# EAGLE schematic Schem1 (EAGLE 6.4)
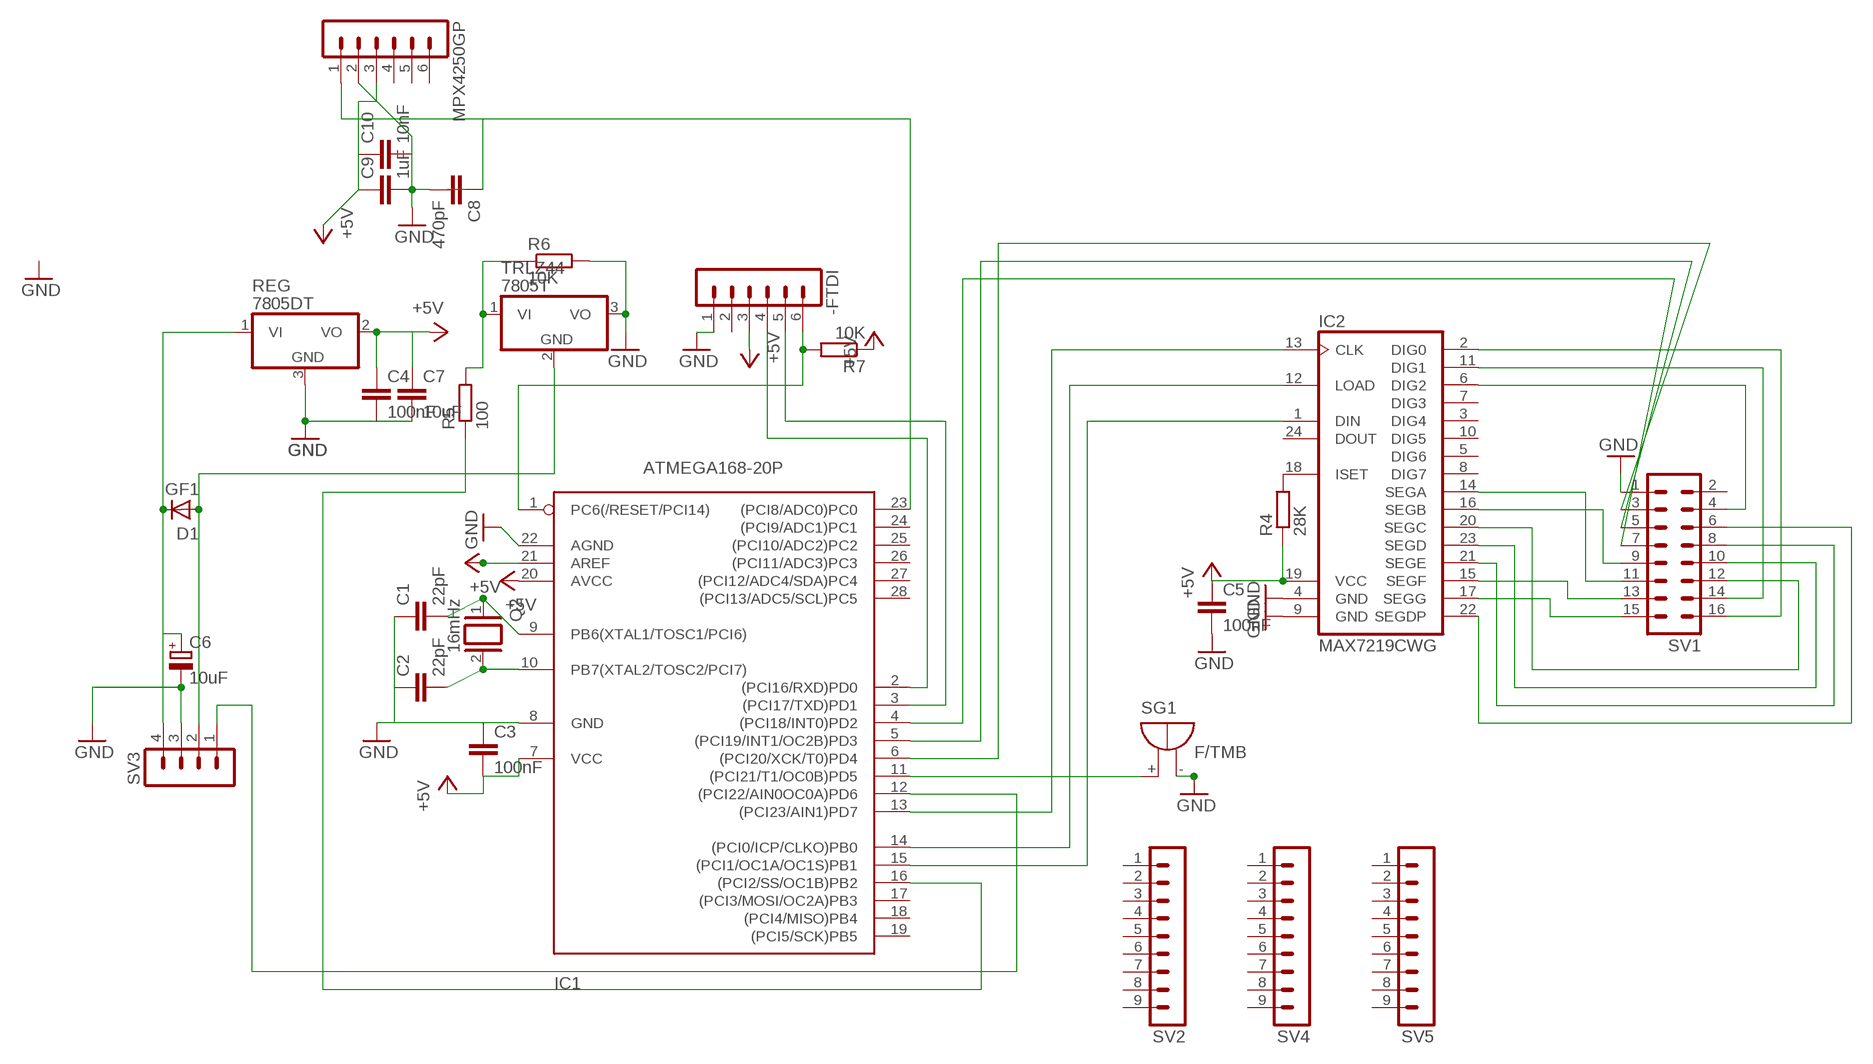
[diagram p0: schematic, sheet 1]

## Parts
-FTDI  MA06-1  [MA06-1]
C1  22pF  C-EUC0805  [C0805]
C2  22pF  C-EUC0805  [C0805]
C3  100nF  C-EUC0805  [C0805]
C4  100nF  C-EUC0805  [C0805]
C5  100nF  C-EUC0805  [C0805]
C6  10uF  CPOL-EUE2,5-6E  [E2,5-6E]
C7  10uF  C-EUC0805  [C0805]
C8  470pF  C-EUC0805  [C0805]
C9  1uF  C-EUC0805  [C0805]
C10  10nF  C-EUC0805  [C0805]
D1  GF1  [SMA-DO214AC]
IC1  ATMEGA168-20P  [DIL28-3]
IC2  MAX7219CWG  [MAX7219CWG]
MPX4250GP  MA06-1  [MA06-1]
Q2  16mHz  XTAL/S  [QS]
R4  28K  R-EU_R0805  [R0805]
R5  100  R-EU_R0805  [R0805]
R6  10K  R-EU_R0805  [R0805]
R7  10K  R-EU_R0805  [R0805]
REG  7805DT  [TO252]
SG1  F/TMB  [F/TMB]
SV1  MA08-2  [MA08-2]
SV2  MA09-1  [MA09-1]
SV3  MA04-1  [MA04-1]
SV4  MA09-1  [MA09-1]
SV5  MA09-1  [MA09-1]
TRLZ44  7805T  [TO220H]

## Nets
+5V: -FTDI.3 C3.2 C4.1 C5.1 C7.1 C9.1 C10.1 IC1.7(VCC) IC1.20(AVCC) IC1.21(AREF) IC2.19(VCC) MPX4250GP.3 R4.1 R7.1 REG.2(VO)
GND: -FTDI.1 C1.1 C2.1 C3.1 C4.2 C5.2 C6.- C7.2 C8.2 C9.2 C10.2 IC1.8(GND) IC1.22(AGND) IC2.4(GND) IC2.9(GND) MPX4250GP.2 R6.2 REG.3(GND) SG1.- SV1.1 SV3.3 TRLZ44.3(VO)
N$1: C1.2 IC1.9(PB6(XTAL1/TOSC1/PCI6)) Q2.1
N$2: R5.2 R6.1 TRLZ44.1(VI)
N$3: IC1.15((PCI1/OC1A/OC1S)PB1) IC2.1(DIN)
N$4: IC2.6(DIG2) SV1.4
N$5: IC2.11(DIG1) SV1.14
N$6: IC2.22(SEGDP) SV1.6
N$7: IC2.21(SEGE) SV1.8
N$8: C8.1 IC1.23((PCI8/ADC0)PC0) MPX4250GP.1
N$9: IC2.23(SEGD) SV1.10
N$10: IC2.20(SEGC) SV1.12
N$11: IC2.2(DIG0) SV1.16
N$12: IC2.17(SEGG) SV1.15
N$13: IC2.15(SEGF) SV1.13
N$14: IC2.14(SEGA) SV1.11
N$15: IC2.18(ISET) R4.2
N$16: IC1.16((PCI2/SS/OC1B)PB2) R5.1
N$17: IC1.14((PCI0/ICP/CLKO)PB0) IC2.12(LOAD)
N$18: IC1.13((PCI23/AIN1)PD7) IC2.13(CLK)
N$19: IC1.4((PCI18/INT0)PD2) SV1.7
N$20: IC1.5((PCI19/INT1/OC2B)PD3) SV1.5
N$21: IC1.6((PCI20/XCK/T0)PD4) SV1.3
N$22: IC1.11((PCI21/T1/OC0B)PD5) SG1.+
N$23: -FTDI.6 IC1.1(PC6(/RESET/PCI14)) R7.2
N$24: -FTDI.4 IC1.2((PCI16/RXD)PD0)
N$25: -FTDI.5 IC1.3((PCI17/TXD)PD1)
N$26: C6.+ D1.K(C) REG.1(VI) SV3.4
N$27: C2.2 IC1.10(PB7(XTAL2/TOSC2/PCI7)) Q2.2
N$28: D1.A SV3.2 TRLZ44.2(GND)
N$29: IC1.12((PCI22/AIN0OC0A)PD6) SV3.1
N$30: IC2.16(SEGB) SV1.9
Unconnected: -FTDI.2 IC1.17((PCI3/MOSI/OC2A)PB3) IC1.18((PCI4/MISO)PB4) IC1.19((PCI5/SCK)PB5) IC1.24((PCI9/ADC1)PC1) IC1.25((PCI10/ADC2)PC2) IC1.26((PCI11/ADC3)PC3) IC1.27((PCI12/ADC4/SDA)PC4) IC1.28((PCI13/ADC5/SCL)PC5) IC2.3(DIG4) IC2.5(DIG6) IC2.7(DIG3) IC2.8(DIG7) IC2.10(DIG5) IC2.24(DOUT) MPX4250GP.4 MPX4250GP.5 MPX4250GP.6 SV1.2 SV2.1 SV2.2 SV2.3 SV2.4 SV2.5 SV2.6 SV2.7 SV2.8 SV2.9 SV4.1 SV4.2 SV4.3 SV4.4 SV4.5 SV4.6 SV4.7 SV4.8 SV4.9 SV5.1 SV5.2 SV5.3 SV5.4 SV5.5 SV5.6 SV5.7 SV5.8 SV5.9

## Library data of the parts
-FTDI MPX4250GP = con-lstb:MA06-1: PIN HEADER; OC_FARNELL: unknown; OC_NEWARK: unknown
C1 C2 = resistor:C-EU: CAPACITOR, European symbol; MF: MURATA; MPN: ERB21B5C2D220JDX1L; OC_FARNELL: 1294526
C3-C5 C7-C10 = resistor:C-EU: CAPACITOR, European symbol; MF: KEMET; MPN: C0805X104K5RACTU; OC_FARNELL: 1414041
C6 = resistor:CPOL-EU: POLARIZED CAPACITOR, European symbol
D1 = diode:GF1: DIODE
IC1 = adafruit:ATMEGA168*P: MICROCONTROLLER 16 kBytes FLASH 1 kBytes SRAM 512 Bytes EEPROM USART 8-channel 10 bit ADC; OC_FARNELL: unknown
IC2 = Custom:MAX7219CWG
Q2 = special:XTAL/S: CRYSTAL; MF: EUROQUARTZ; MPN: 16.000MHZ HC49/4H/30/50/40/18PF/ATF; OC_FARNELL: 1640875
R4-R7 = resistor:R-EU_: RESISTOR, European symbol
REG TRLZ44 = linear:78*: Positive VOLTAGE REGULATOR Source: http://cache.national.com/ds/LM/LM78L05.pdf http://www.fairchildsemi.com/ds/LM/LM7805.pdf; OC_FARNELL: unknown
SG1 = buzzer:F/TMB: BUZZER Source: Buerklin; OC_FARNELL: unknown; OC_NEWARK: unknown
SV1 = con-lstb:MA08-2: PIN HEADER; OC_FARNELL: unknown; OC_NEWARK: unknown
SV2 SV4 SV5 = con-lstb:MA09-1: PIN HEADER; OC_FARNELL: unknown; OC_NEWARK: unknown
SV3 = con-lstb:MA04-1: PIN HEADER; OC_FARNELL: unknown; OC_NEWARK: unknown